# EAGLE schematic LZ3003_1 (EAGLE 7.7.0)
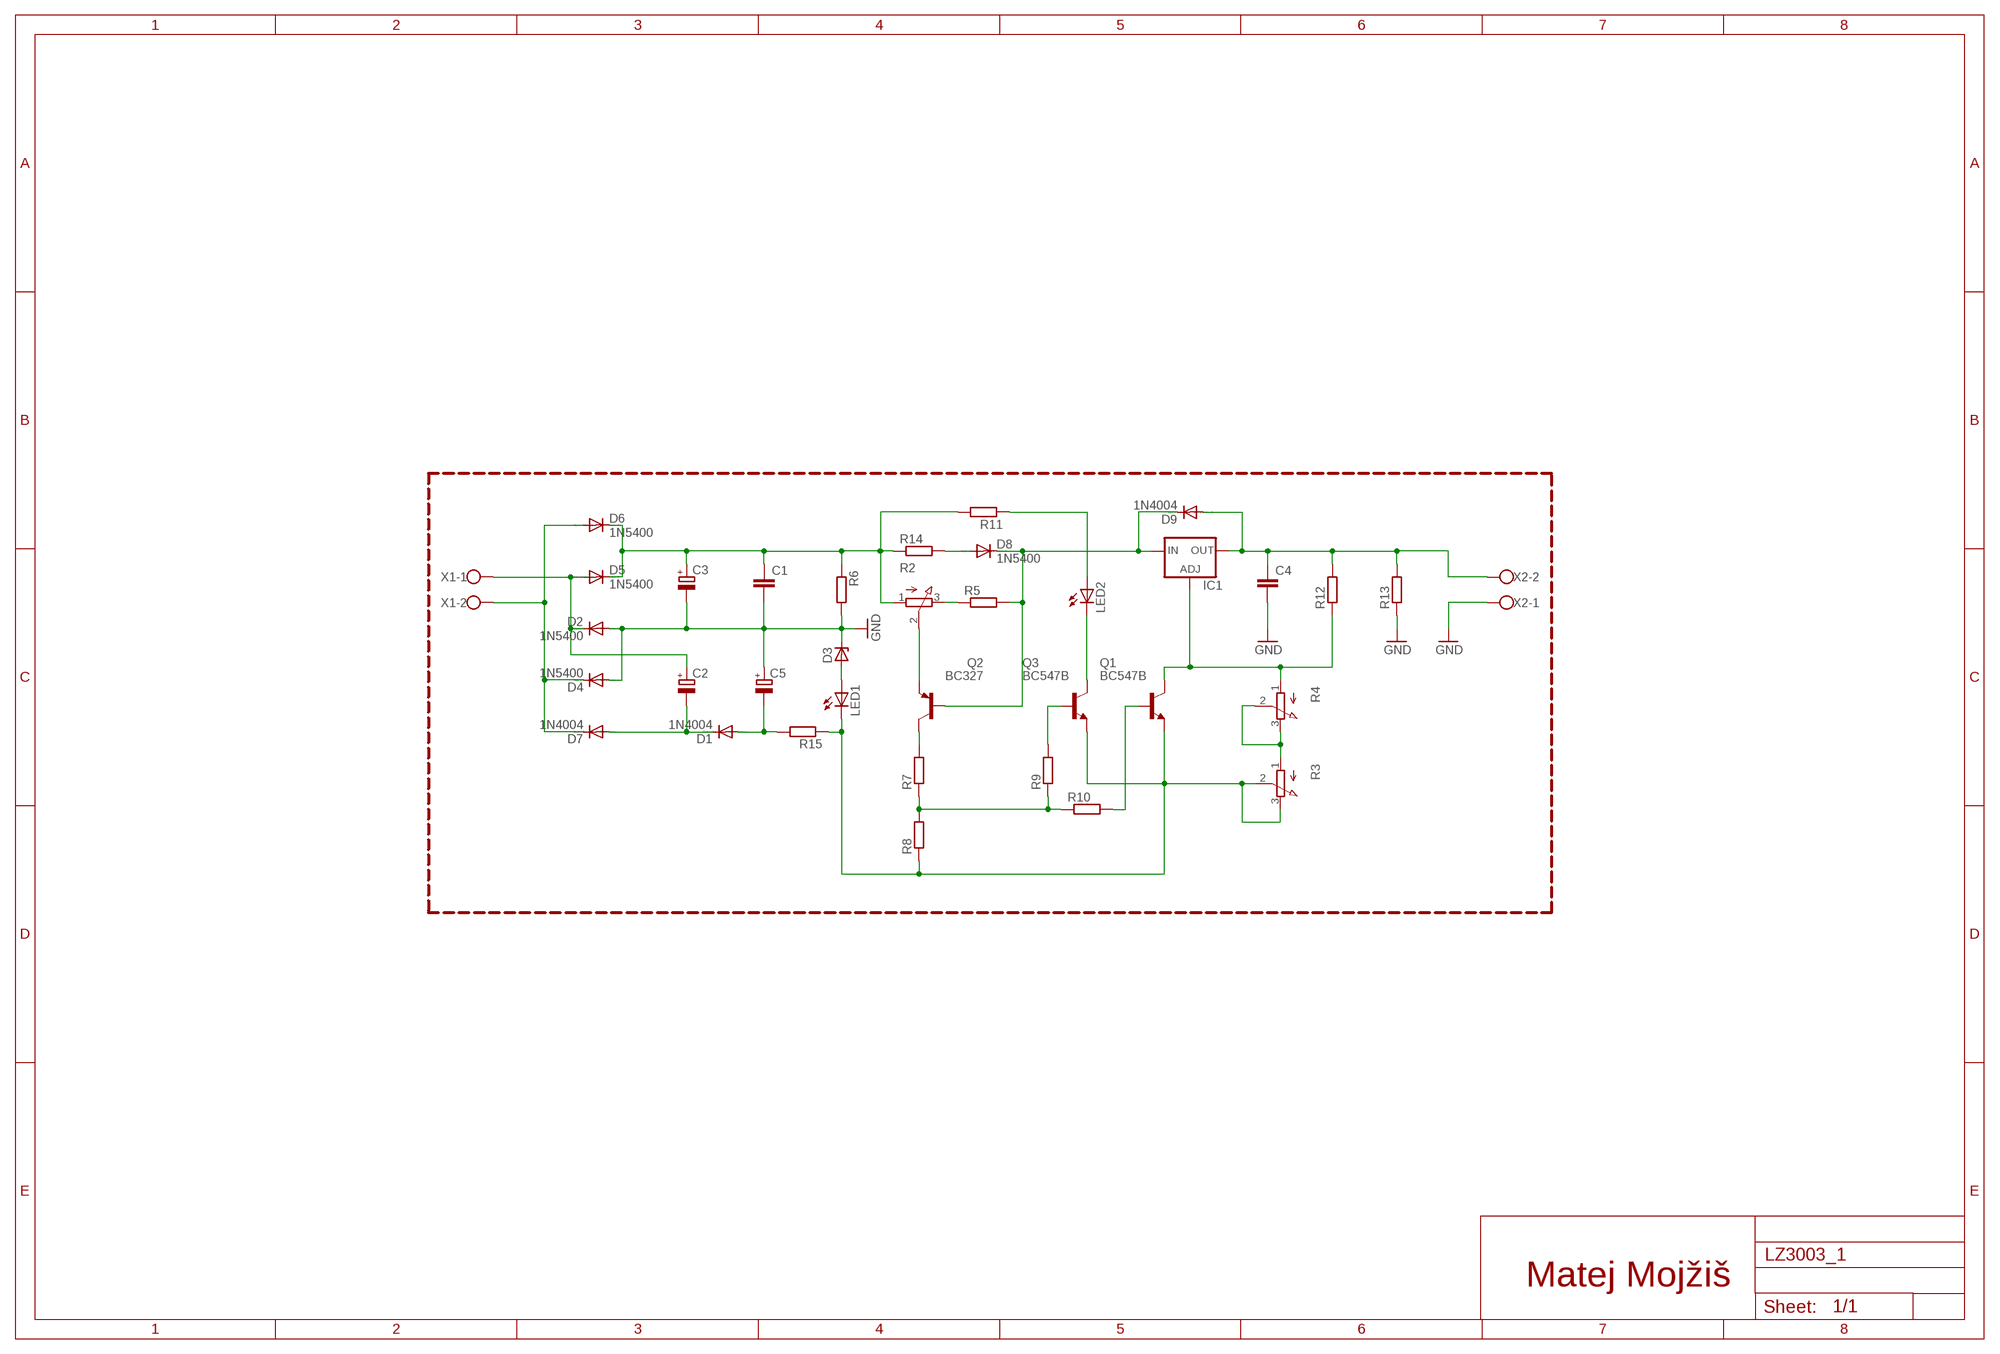
[diagram p0: schematic, sheet 1]

## Parts
C1  C-EU050-025X075  [C050-025X075]
C2  CPOL-EUE5-8.5  [E5-8,5]
C3  CPOL-EUE7.5-16  [E7,5-16]
C4  C-EU050-025X075  [C050-025X075]
C5  CPOL-EUE5-8.5  [E5-8,5]
D1  1N4004  [DO41-10]
D2  1N5400  [DO201-15]
D3  ZENER-DIODEDO34-7  [DO34Z7]
D4  1N5400  [DO201-15]
D5  1N5400  [DO201-15]
D6  1N5400  [DO201-15]
D7  1N4004  [DO41-10]
D8  1N5400  [DO201-15]
D9  1N4004  [DO41-10]
IC1  LM317TS  [317TS]
LED1  LED5MM  [LED5MM]
LED2  LED5MM  [LED5MM]
Q1  BC547B  [TO92]
Q2  BC327  [TO92-EBC]
Q3  BC547B  [TO92]
R2  3RP/1610N  [3RP/1610N]
R3  3RP/1610N  [3RP/1610N]
R4  3RP/1610N  [3RP/1610N]
R5  R-EU_0207/7  [0207/7]
R6  R-EU_0207/7  [0207/7]
R7  R-EU_0207/7  [0207/7]
R8  R-EU_0207/7  [0207/7]
R9  R-EU_0207/7  [0207/7]
R10  R-EU_0207/7  [0207/7]
R11  R-EU_0207/7  [0207/7]
R12  R-EU_0207/7  [0207/7]
R13  R-EU_0207/7  [0207/7]
R14  R-EU_VTA52  [VTA52]
R15  R-EU_0207/7  [0207/7]
X1  W237-102  [W237-102]
X2  W237-102  [W237-102]

## Nets
GND: C1.2 C3.- C4.2 C5.+ D2.A D3.C D4.A R6.2 R13.1 X2.1
N$1: C2.- D1.C D7.A
N$2: D8.A R14.2
N$3: C2.+ D2.C D5.A X1.1
N$4: R2.3(E) R5.1
N$5: D4.C D6.A D7.C X1.2
N$6: C5.- D1.A R15.2
N$7: D3.A LED1.A
N$8: LED1.K(C) Q1.1(E) Q3.1(E) R3.2(S) R3.3(E) R8.1 R15.1
N$9: C1.1 C3.+ D5.C D6.C R2.1(A) R6.1 R11.2 R14.1
N$10: Q2.E R2.2(S)
N$11: Q2.C R7.2
N$12: R7.1 R8.2 R9.1 R10.1
N$13: Q1.2(B) R10.2
N$14: Q3.2(B) R9.2
N$16: R3.1(A) R4.2(S) R4.3(E)
N$20: LED2.A R11.1
N$21: D8.C D9.C IC1.3(IN) Q2.B R5.2
N$22: LED2.K(C) Q3.3(C)
N$24: C4.1 D9.A IC1.2(OUT) R12.2 R13.2 X2.2
N$26: IC1.1(ADJ) Q1.3(C) R4.1(A) R12.1

## Notes on the sheet
- Matej Mojžiš

## Library data of the parts
C1 C4 = rcl:C-EU: CAPACITOR, European symbol
C2 C3 C5 = rcl:CPOL-EU: POLARIZED CAPACITOR, European symbol
D1 D7 D9 = diode:1N4004: DIODE general purpose rectifier, 1 A
D2 D4-D6 D8 = diode:1N5400: DIODE standard rectifier, 3 A, 50 V (Motorola)
D3 = diode:ZENER-DIODE: Z-Diode
IC1 = v-reg:LM317TS: VOLTAGE REGULATOR
LED1 LED2 = led:LED: LED OSRAM: - CHIPLED LG R971, LG N971, LY N971, LG Q971, LY Q971, LO R971, LY R971 LH N974, LH R974 LS Q976, LO Q976, LY Q976 LO Q996 - Hyper CHIPLED LW Q18S LB Q993, LB Q99A, LB R99A - SideLED LS A670, LO A670, LY A670, LG A670, LP A670 LB A673, LV A673, LT A673, LW A673 LH A674 LY A675 LS A676, LA A676, LO A676, LY A676, LW A676 LS A679, LY A679, LG A679 - Hyper Micro SIDELED® LS Y876, LA Y876, LO Y876, LY Y876 LT Y87S - SmartLED LW L88C, LW L88S LB L89C, LB L89S, LG L890 LS L89K, LO L89K, LY L89K LS L896, LA L896, LO L896, LY L896 - TOPLED LS T670, LO T670, LY T670, LG T670, LP T670 LSG T670, LSP T670, LSY T670, LOP T670, LYG T670 LG T671, LOG T671, LSG T671 LB T673, LV T673, LT T673, LW T673 LH T674 LS T676, LA T676, LO T676, LY T676, LB T676, LH T676, LSB T676, LW T676 LB T67C, LV T67C, LT T67C, LS T67K, LO T67K, LY T67K, LW E67C LS E67B, LA E67B, LO E67B, LY E67B, LB E67C, LV E67C, LT E67C LW T67C LS T679, LY T679, LG T679 LS T770, LO T770, LY T770, LG T770, LP T770 LB T773, LV T773, LT T773, LW T773 LH T774 LS E675, LA E675, LY E675, LS T675 LS T776, LA T776, LO T776, LY T776, LB T776 LHGB T686 LT T68C, LB T68C - Hyper Mini TOPLED® LB M676 - Mini TOPLED Santana® LG M470 LS M47K, LO M47K, LY M47K Source: http://www.osram.convergy.de LUXEON: - LUMILED® LXK2-PW12-R00, LXK2-PW12-S00, LXK2-PW14-U00, LXK2-PW14-V00 LXK2-PM12-R00, LXK2-PM12-S00, LXK2-PM14-U00 LXK2-PE12-Q00, LXK2-PE12-R00, LXK2-PE12-S00, LXK2-PE14-T00, LXK2-PE14-U00 LXK2-PB12-K00, LXK2-PB12-L00, LXK2-PB12-M00, LXK2-PB14-N00, LXK2-PB14-P00, LXK2-PB14-Q00 LXK2-PR12-L00, LXK2-PR12-M00, LXK2-PR14-Q00, LXK2-PR14-R00 LXK2-PD12-Q00, LXK2-PD12-R00, LXK2-PD12-S00 LXK2-PH12-R00, LXK2-PH12-S00 LXK2-PL12-P00, LXK2-PL12-Q00, LXK2-PL12-R00 Source: www.luxeon.com KINGBRIGHT: KA-3528ASYC Source: www.kingbright.com
Q1 Q3 = transistor-npn:BC547*: NPN Transistor
Q2 = transistor-pnp:BC327*: PNP Transistror
R2-R4 = pot:3RP/1610N: 16mm Potentiometer one level Source: http://www.alphapotentiometers.net/html/16mm_pot_2.html
R5-R15 = rcl:R-EU_: RESISTOR, European symbol
X1 X2 = con-wago-500:W237-102: WAGO SCREW CLAMP; MPN: 237-102; OC_FARNELL: unknown; OC_NEWARK: 70K9898